# Altium schematic sheet [9]_MOT_tMCU MKV58.SchDoc
size A3; DocumentNumber: 9; SheetNumber: 9; SheetTotal: 12; Ngu?i ki?m tra: bangdd; Ngu?i thi?t k?: thannt114
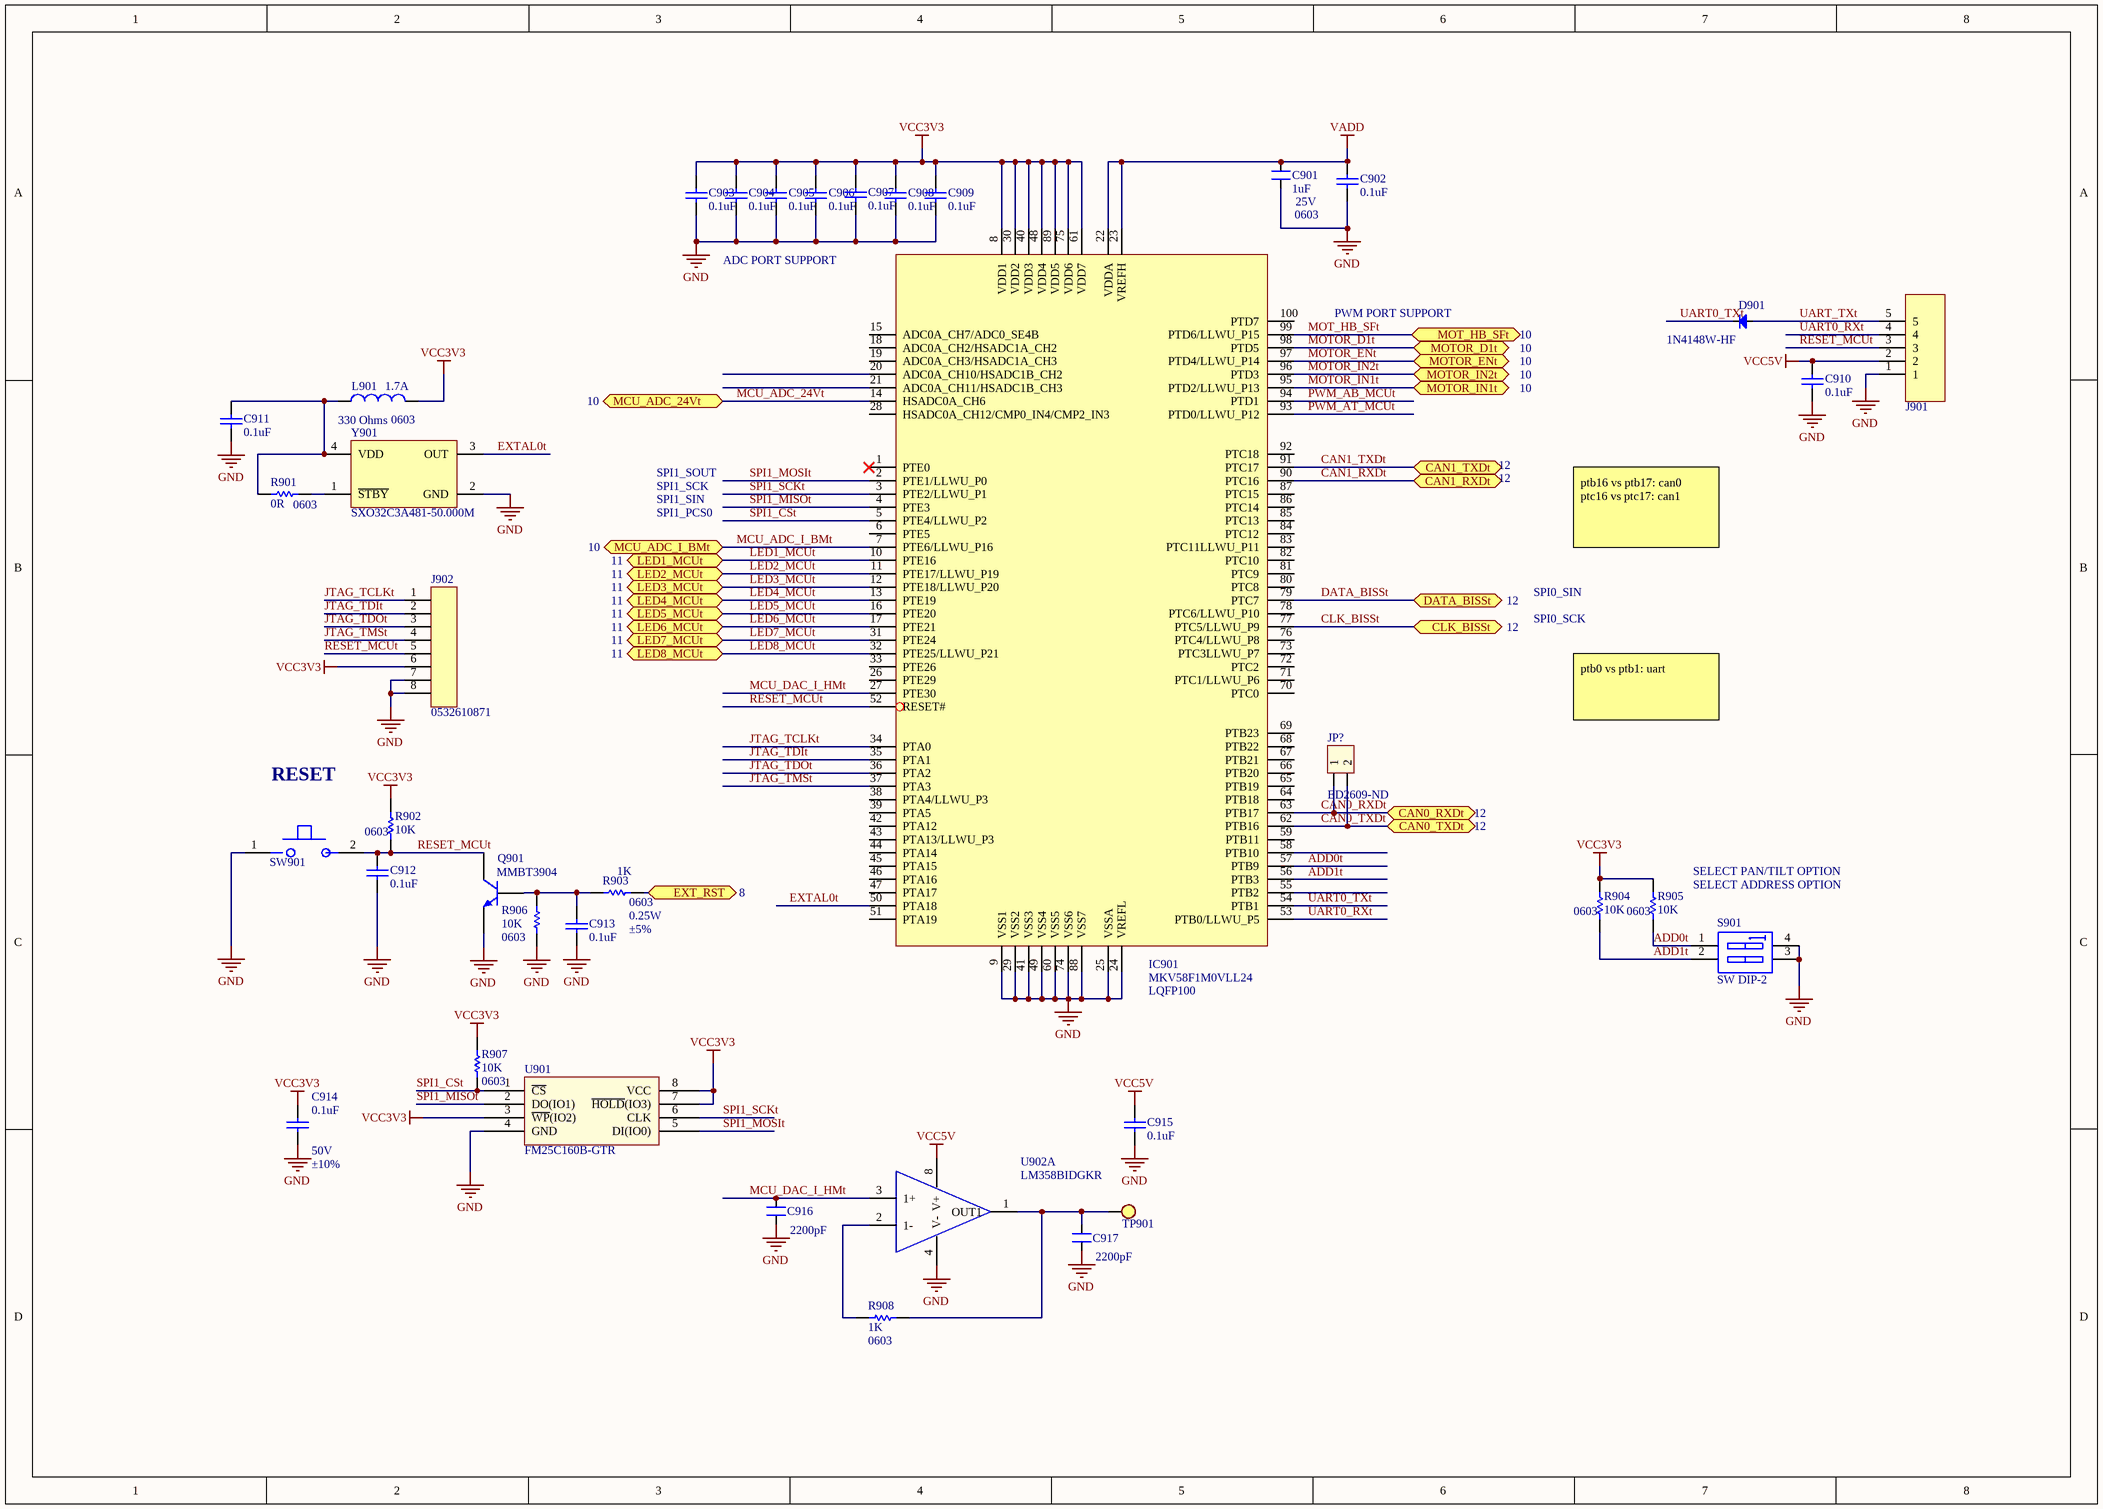
[diagram p0: [9]_MOT_tMCU MKV58.SchDoc]

## Parts
C901  PCB FOOTPRINT: 0603  Voltage: 25V  [CAP 0603]  (hidden comment: 1uF)
C902  0.1uF  [CAP 0603]
C903  0.1uF  [CAP 0603]
C904  0.1uF  [CAP 0603]
C905  0.1uF  [CAP 0603]
C906  0.1uF  [CAP 0603]
C907  0.1uF  [CAP 0603]
C908  0.1uF  [CAP 0603]
C909  0.1uF  [CAP 0603]
C910  0.1uF  [CAP 0603]
C911  0.1uF  [CAP 0603]
C912  0.1uF  [CAP 0603]
C913  0.1uF  [CAP 0603]
C914  Voltage: 50V  Tolerance: ±10%  [CAP 0603]  (hidden comment: 0.1uF)
C915  0.1uF  [CAP 0603]
C916  2200pF  [CAP 0603]
C917  2200pF  [CAP 0603]
D901  1N4148W-HF  [DIO-SMD-123]
IC901  MANUFACTURER1_PART#: MKV58F1M0VLL24  PACKAGE: LQFP100  [100-LQFP]  (hidden comment: IC;IC MCU 32BIT 1MB FLASH 100LQFP,100-LQFP,-40TO 105°C,MKV58F1M0VLL24)
J901  HEADER;HEADER 5 POS 2.54MM  [HEADER 5 2.54MM]  (value not drawn)
J902  Manufacturer Part Number: 0532610871  [CONN-8]  (hidden comment: CONN-SMD;CONN HEADER SMD R/A,M,1Rx8Px1.25MM,0532610871)
JP?  ED2609-ND  [MF52A2103J3470]
L901  PCB Footprint: 0603  Current: 1.7A  [FB 0603]  (hidden comment: 330 Ohms)
Q901  MMBT3904  [SOT-23]
R901  PCB Footprint: 0603  [res 0603]  (hidden comment: 0R)  (no BOM)
R902  PCB Footprint: 0603  [res 0603]  (hidden comment: 10K)
R903  PCB Footprint: 0603  Power: 0.25W  Tolerance: ±5%  [res 0603]  (hidden comment: 1K)
R904  PCB Footprint: 0603  [res 0603]  (hidden comment: 10K)
R905  PCB Footprint: 0603  [res 0603]  (hidden comment: 10K)
R906  PCB Footprint: 0603  [res 0603]  (hidden comment: 10K)
R907  PCB Footprint: 0603  [res 0603]  (hidden comment: 10K)
R908  PCB Footprint: 0603  [res 0603]  (hidden comment: 1K)
S901  SW DIP-2  [219-2LPSTR]
SW901  SWITCH;TACTILE SWITCH SPST-NO TOP ACTUATED,2-SMD,MJTP1106STR  [SW]  (value not drawn)
TP901  TP SMD  [TESTPOINT]  (value not drawn)  (no BOM)
U901  FM25C160B-GTR  [SOIC-8 150MIL]
U902  LM358BIDGKR  [8-VSSOP]  (part A of 2)
Y901  SXO32C3A481-50.000M  [DFN210P320X85-4N]

## Ports
CAN0_RXDt (bidir, see 12), CAN0_TXDt (bidir, see 12), CAN1_RXDt (bidir, see 12), CAN1_TXDt (bidir, see 12), CLK_BISSt (bidir, see 12), DATA_BISSt (bidir, see 12), EXT_RST (bidir, see 8), LED1_MCUt (bidir, see 11), LED2_MCUt (bidir, see 11), LED3_MCUt (bidir, see 11), LED4_MCUt (bidir, see 11), LED5_MCUt (bidir, see 11), LED6_MCUt (bidir, see 11), LED7_MCUt (bidir, see 11), LED8_MCUt (bidir, see 11), MCU_ADC_24Vt (bidir, see 10), MCU_ADC_I_BMt (bidir, see 10), MOT_HB_SFt (bidir, see 10), MOTOR_D1t (bidir, see 10), MOTOR_ENt (bidir, see 10), MOTOR_IN1t (bidir, see 10), MOTOR_IN2t (bidir, see 10)

## Nets
GND: C901.2 C902.2 C903.2 C904.2 C905.2 C906.2 C907.2 C908.2 C909.2 C910.2 C911.2 C912.2 C913.2 C914.2 C915.1 C916.2 C917.2 IC901.9(VSS1) IC901.24(VREFL) IC901.25(VSSA) IC901.29(VSS2) IC901.41(VSS3) IC901.49(VSS4) IC901.60(VSS5) IC901.74(VSS6) IC901.88(VSS7) J901.1 J902.7 J902.8 Q901.2(E) R906.2 S901.3(B2) S901.4(B1) SW901.1 U901.4(GND) U902.4(V-) Y901.2(GND)
VADD: C901.1 C902.1 IC901.22(VDDA) IC901.23(VREFH)
VCC3V3: C903.1 C904.1 C905.1 C906.1 C907.1 C908.1 C909.1 C914.1 IC901.8(VDD1) IC901.30(VDD2) IC901.40(VDD3) IC901.48(VDD4) IC901.61(VDD7) IC901.75(VDD6) IC901.89(VDD5) J902.6 L901.2 R902.1 R904.1 R905.1 R907.1 U901.3(~{WP}(IO2)) U901.7(~{HOLD}(IO3)) U901.8(VCC)
VCC5V: C910.1 C915.2 J901.2 U902.8(V+)
ADD0t: IC901.57(PTB9) R905.2 S901.1(A1)
ADD1t: IC901.56(PTB3) R904.2 S901.2(A2)
CAN0_RXDt: IC901.63(PTB17) JP?.1 ; port CAN0_RXDt
CAN0_TXDt: IC901.62(PTB16) JP?.2 ; port CAN0_TXDt
CAN1_RXDt: IC901.90(PTC16) ; port CAN1_RXDt
CAN1_TXDt: IC901.91(PTC17) ; port CAN1_TXDt
CLK_BISSt: IC901.77(PTC5/LLWU_P9) ; port CLK_BISSt
DATA_BISSt: IC901.79(PTC7) ; port DATA_BISSt
EXT_RST: R903.1 ; port EXT_RST
EXTAL0t: IC901.50(PTA18) Y901.3(OUT)
JTAG_TCLKt: IC901.34(PTA0) J902.1
JTAG_TDIt: IC901.35(PTA1) J902.2
JTAG_TDOt: IC901.36(PTA2) J902.3
JTAG_TMSt: IC901.37(PTA3) J902.4
LED1_MCUt: IC901.10(PTE16) ; port LED1_MCUt
LED2_MCUt: IC901.11(PTE17/LLWU_P19) ; port LED2_MCUt
LED3_MCUt: IC901.12(PTE18/LLWU_P20) ; port LED3_MCUt
LED4_MCUt: IC901.13(PTE19) ; port LED4_MCUt
LED5_MCUt: IC901.16(PTE20) ; port LED5_MCUt
LED6_MCUt: IC901.17(PTE21) ; port LED6_MCUt
LED7_MCUt: IC901.31(PTE24) ; port LED7_MCUt
LED8_MCUt: IC901.32(PTE25/LLWU_P21) ; port LED8_MCUt
MCU_ADC_24Vt: IC901.14(HSADC0A_CH6) ; port MCU_ADC_24Vt
MCU_ADC_I_BMt: IC901.7(PTE6/LLWU_P16) ; port MCU_ADC_I_BMt
MCU_DAC_I_HMt: C916.1 IC901.27(PTE30) U902.3(1+)
MOT_HB_SFt: IC901.99(PTD6/LLWU_P15) ; port MOT_HB_SFt
MOTOR_D1t: IC901.98(PTD5) ; port MOTOR_D1t
MOTOR_ENt: IC901.97(PTD4/LLWU_P14) ; port MOTOR_ENt
MOTOR_IN1t: IC901.95(PTD2/LLWU_P13) ; port MOTOR_IN1t
MOTOR_IN2t: IC901.96(PTD3) ; port MOTOR_IN2t
PWM_AB_MCUt: IC901.94(PTD1)
PWM_AT_MCUt: IC901.93(PTD0/LLWU_P12)
RESET_MCUt: C912.1 IC901.52(RESET#) J901.3 J902.5 Q901.3(C) R902.2 SW901.2
SPI1_CSt: IC901.5(PTE4/LLWU_P2) R907.2 U901.1(~{CS})
SPI1_MISOt: IC901.4(PTE3) U901.2(DO(IO1))
SPI1_MOSIt: IC901.2(PTE1/LLWU_P0) U901.5(DI(IO0))
SPI1_SCKt: IC901.3(PTE2/LLWU_P1) U901.6(CLK)
UART0_RXt: IC901.53(PTB0/LLWU_P5) J901.4
UART0_TXt: D901.2(K) IC901.54(PTB1)
UART_TXt: D901.1(A) J901.5
NetC911_1: C911.1 L901.1 R901.1 Y901.4(VDD)
NetC913_1: C913.1 Q901.1(B) R903.2 R906.1
NetC917_1: C917.1 R908.2 TP901.1 U902.1(OUT1)
NetR901_2: R901.2 Y901.1(~{STBY})
NetR908_1: R908.1 U902.2(1-)

Not connected (* = marked no-connect by the designer): IC901 1(PTE0)* 6(PTE5) 15(ADC0A_CH7/ADC0_SE4B) 18(ADC0A_CH2/HSADC1A_CH2) 19(ADC0A_CH3/HSADC1A_CH3) 20(ADC0A_CH10/HSADC1B_CH2) 21(ADC0A_CH11/HSADC1B_CH3) 26(PTE29) 28(HSADC0A_CH12/CMP0_IN4/CMP2_IN3) 33(PTE26) 38(PTA4/LLWU_P3) 39(PTA5) 42(PTA12) 43(PTA13/LLWU_P3) 44(PTA14) 45(PTA15) 46(PTA16) 47(PTA17) 51(PTA19) 55(PTB2) 58(PTB10) 59(PTB11) 64(PTB18) 65(PTB19) 66(PTB20) 67(PTB21) 68(PTB22) 69(PTB23) 70(PTC0) 71(PTC1/LLWU_P6) 72(PTC2) 73(PTC3LLWU_P7) 76(PTC4/LLWU_P8) 78(PTC6/LLWU_P10) 80(PTC8) 81(PTC9) 82(PTC10) 83(PTC11LLWU_P11) 84(PTC12) 85(PTC13) 86(PTC14) 87(PTC15) 92(PTC18) 100(PTD7)

## Notes on the sheet
- ADC PORT SUPPORT
- PWM PORT SUPPORT
- SPI1_SOUT
- SPI1_SCK
- SPI1_SIN
- SPI1_PCS0
- ptb16 vs ptb17: can0
  ptc16 vs ptc17: can1
- SPI0_SIN
- SPI0_SCK
- ptb0 vs ptb1: uart
- RESET
- SELECT PAN/TILT OPTION
- SELECT ADDRESS OPTION

## Library data of the parts
C901 = Cap_1uF: CAP CER 1UF 25V X7R 0603; MANUFACTURER1: Samsung Electro-Mechanics; MANUFACTURER1_PART#: CL10A105KA8NNNC; MANUFACTURER2_PART#: TMK107B7105KA-T; PACKING: TR; UNIT: PCS; Material: X5R; Process Type: SM; Tolerance: 10%; Value: 1uF; CATEGORY: CAP CER; PCB_ Footprint: 0603; MANUFACTURER2: Taiyo Yuden; LOH_Code: *
C902-C913 C915 = Cap: CAP-CER,SMD;0.1UF,10%,50V,X7R,0603; MANUFACTURER1: Samsung Electro-Mechanics; MANUFACTURER1_PART#: CL10B104KB8NNNC; MANUFACTURER2_PART#: M0603X104K050TAX; MANUFACTURER1: SS; Unit: PCS; PACKING: Tape & Reel (TR); PCB FOOTPRINT: 0603; Process Type: SM; CATEGORY: CAP-CER; VALUE: 0.1uF; FOOTPRINT: 0603; Material: X7R; Voltage: 50V; Tolerance: ±10%; MANUFACTURER2: UWA
C914 = Cap: CAP-CER,SMD;0.1UF,10%,50V,X7R,0603; MANUFACTURER1: Samsung Electro-Mechanics; MANUFACTURER1_PART#: CL10B104KB8NNNC; MANUFACTURER2_PART#: M0603X104K050TAX; MANUFACTURER1: SS; Unit: PCS; PACKING: Tape & Reel (TR); PCB FOOTPRINT: 0603; Process Type: SM; LOH_Code: 101100038; CATEGORY: CAP-CER; VALUE: 0.1uF; FOOTPRINT: 0603; Material: X7R; MANUFACTURER2: UWA
C916 C917 = CN: CAP CER 2200PF 50V X7R 0603; MANUFACTURER1: Samsung Electro-Mechanics; MANUFACTURER1_PART#: CL10B222KB8NFNC; PACKING: TR; PCB FOOTPRINT: 0603; PROCESS_TYPE: SMT; Tolerance: ±10%; Value: 2200pF; CATEGORY: CAP CER; Voltage - Rated: 50V; Temperature Coefficient: X7R
D901 = Diode SMD: Default Diode; MANUFACTURER1: Comchip; VOLTAGE: 75V; CURRENT: 150mA; MANUFACTURER1_PART#: 1N4148W-HF; Value: 1N4148W-HF
IC901 = IC;IC MCU 32BIT 1MB FLASH 100LQFP,100-LQFP,-40TO 105°C,MKV58F1M0VLL24: IC MCU 32BIT 1MB FLASH 100LQFP; Manufacturer: NXP USA Inc.; Manufacturer Part Number: MKV58F1M0VLL24; Category: IC; MANUFACTURER1: NXP USA Inc.
J901 = HEADER;HEADER 5 POS 2.54MM: HEADER 5 POS 2.54MM; MANUFACTURER1: LKCL; MANUFACTURER1_PART#: XH2.54-5P
J902 = CONN-SMD;CONN HEADER SMD R/A,M,1Rx8Px1.25MM,0532610871: CONN HEADER SMD R/A 8POS 1.25MM; MANUFACTURER1: Molex; Category: CONN; MANUFACTURER1_PART#: 0532610871
JP? = Con2: 2 Position Wire to Board Terminal Block Horizontal with Board 0.200" (5.08mm) Through Hole; Value: Connector 2; Digikey: ED2609-ND
L901 = inductor 2.2uF: FERRITE BEAD 330 OHM 0603 1LN; MANUFACTURER1: TDK Corporation; MANUFACTURER1_PART#: MPZ1608S331ATA00; MANUFACTURER2_PART#: BLM18KG331SN1D; PACKING: Tape & Reel (TR); Process Type: SM; Unit: PCS; Tolerance: ±10%; Category: Inductor; DESCRIPTION_: FERRITE BEAD 330 OHM 0603 1LN; MANUFACTURER2: Murata Electronics; Value: 330 Ohms
Q901 = NPN: NPN 200mA 40V 350mW SOT-23 Transistors; MANUFACTURER1: Guangdong Hottech; PROCESS_TYPE: SM; PACKAGE: SOT23; Category: TRANSISTOR; MANUFACTURER2: HT(Shenzhen Jinyu Semicon); MANUFACTURER2_PART#: MMBT3904; MANUFACTURER1_PART#: MMBT3904; Value: MMBT3904
R901 = Res0.3: RES SMD 0 OHM JUMPER 1/10W 0603; MANUFACTURER1: Yageo; MANUFACTURER1_PART#: RC0603JR-070RL; MANUFACTURER2_PART#: RMCF0603ZT0R00; PACKING: Tape & Reel (TR); Process Type: SM; Unit: PCS; Power: 0.25W; Tolerance: 5%; Value: 0R; CATEGORY: RES SMD; MANUFACTURER2: Stackpole Electronics Inc
R902 R904-R907 = Res0.3: RES SMD,10K OHM 5% 1/10W 0603; MANUFACTURER1: Stackpole Electronics Inc; MANUFACTURER1_PART#: RMCF0603JT10K0; MANUFACTURER2_PART#: R0603J10KKDX; PACKING: Tape & Reel (TR); Process Type: SM; Unit: PCS; Power: 0.25W; Value: 10K; CATEGORY: RES-SMD; MANUFACTURER2: UWA; Tolerance: ±5%
R903 = Res0.3: RES SMD,1K OHM,5%,1/10W,0603; MANUFACTURER1: Stackpole Electronics Inc; MANUFACTURER1_PART#: RMCF06031K00JNEAC; MANUFACTURER2_PART#: R0603J1KTG; DESCCRIPTION: RES SMD 1K OHM 5% 1/10W 0603; PACKING: Tape & Reel (TR); Process Type: SM; Unit: PCS; LOH_Code: 140100083; Value: 1K; CATEGORY: RES SMD; MANUFACTURER2: UWA
R908 = Res0.3: RES SMD,1K OHM,5%,1/10W,0603; MANUFACTURER1: Stackpole Electronics Inc; MANUFACTURER1_PART#: RMCF06031K00JNEAC; MANUFACTURER2_PART#: R0603J1KTG; DESCCRIPTION: RES SMD 1K OHM 5% 1/10W 0603; PACKING: Tape & Reel (TR); Process Type: SM; Unit: PCS; LOH_Code: 140100083; Power: 0.25W; Value: 1K; CATEGORY: RES SMD; MANUFACTURER2: UWA; Tolerance: ±5%
S901 = SW DIP-2: DIP SWITCH, SPST, 2.54 PITCH, F; MANUFACTURER1_PART#: DS04-254-2-02BK-SMT; MANUFACTURER1: CUI; PRICE: 0.48800; CATEGORY: SWITCH; LINK: https://www.digikey.com/en/products/detail/cui-devices/DS04-254-2-02BK-SMT/11310860
SW901 = SWITCH;TACTILE SWITCH SPST-NO TOP ACTUATED,2-SMD,MJTP1106STR: SWITCH TACTILE SPST-NO 0.05A 12V; MANUFACTURER1: APEM Inc.; Manufacturer Part Number: MJTP1106STR; Category: BUTTON; MANUFACTURER1_PART#: MJTP1106STR
TP901 = TP SMD: TEST POINT
U901 = IC Flash W25Q16JVSNIQ QUAD SO8: IC FRAM 16KBIT SPI 20MHZ 8SOIC; MANUFACTURER1: Cypress; PACKING: Tape & Reel (TR); PCB Footprint: SO8; Process Type: SM; Unit: PCS; Voltage: 2.7V ~ 3.6V; Category: IC; MANUFACTURER1_PART#: FM25C160B-GTR; Value: FM25C160B-GTR
U902 = LM358BIDGKR: IC OPAMP GP 2 CIRCUIT 8VSSOP; Manufacturer Part Number: LM358BIDGKR
Y901 = OSCILLATOR;50MHZ,50ppm,3.2x2.5mm,ASEMB-50.000MHZ-LC-T: MEMS OSC XO 50.0000MHZ CMOS SMD; MANUFACTURER1: Suntsu; Manufacturer Part Number: SXO32C3A481-50.000M; MANUFACTURER1_PART#: SXO32C3A481-50.000M; VALUE: SXO32C3A481-50.000M